# EAGLE design Controller (EAGLE 7.5.0)
CNAME: Mooring Lights Controller; CREVISION: 0.1.1; DESIGNER: John Bayly
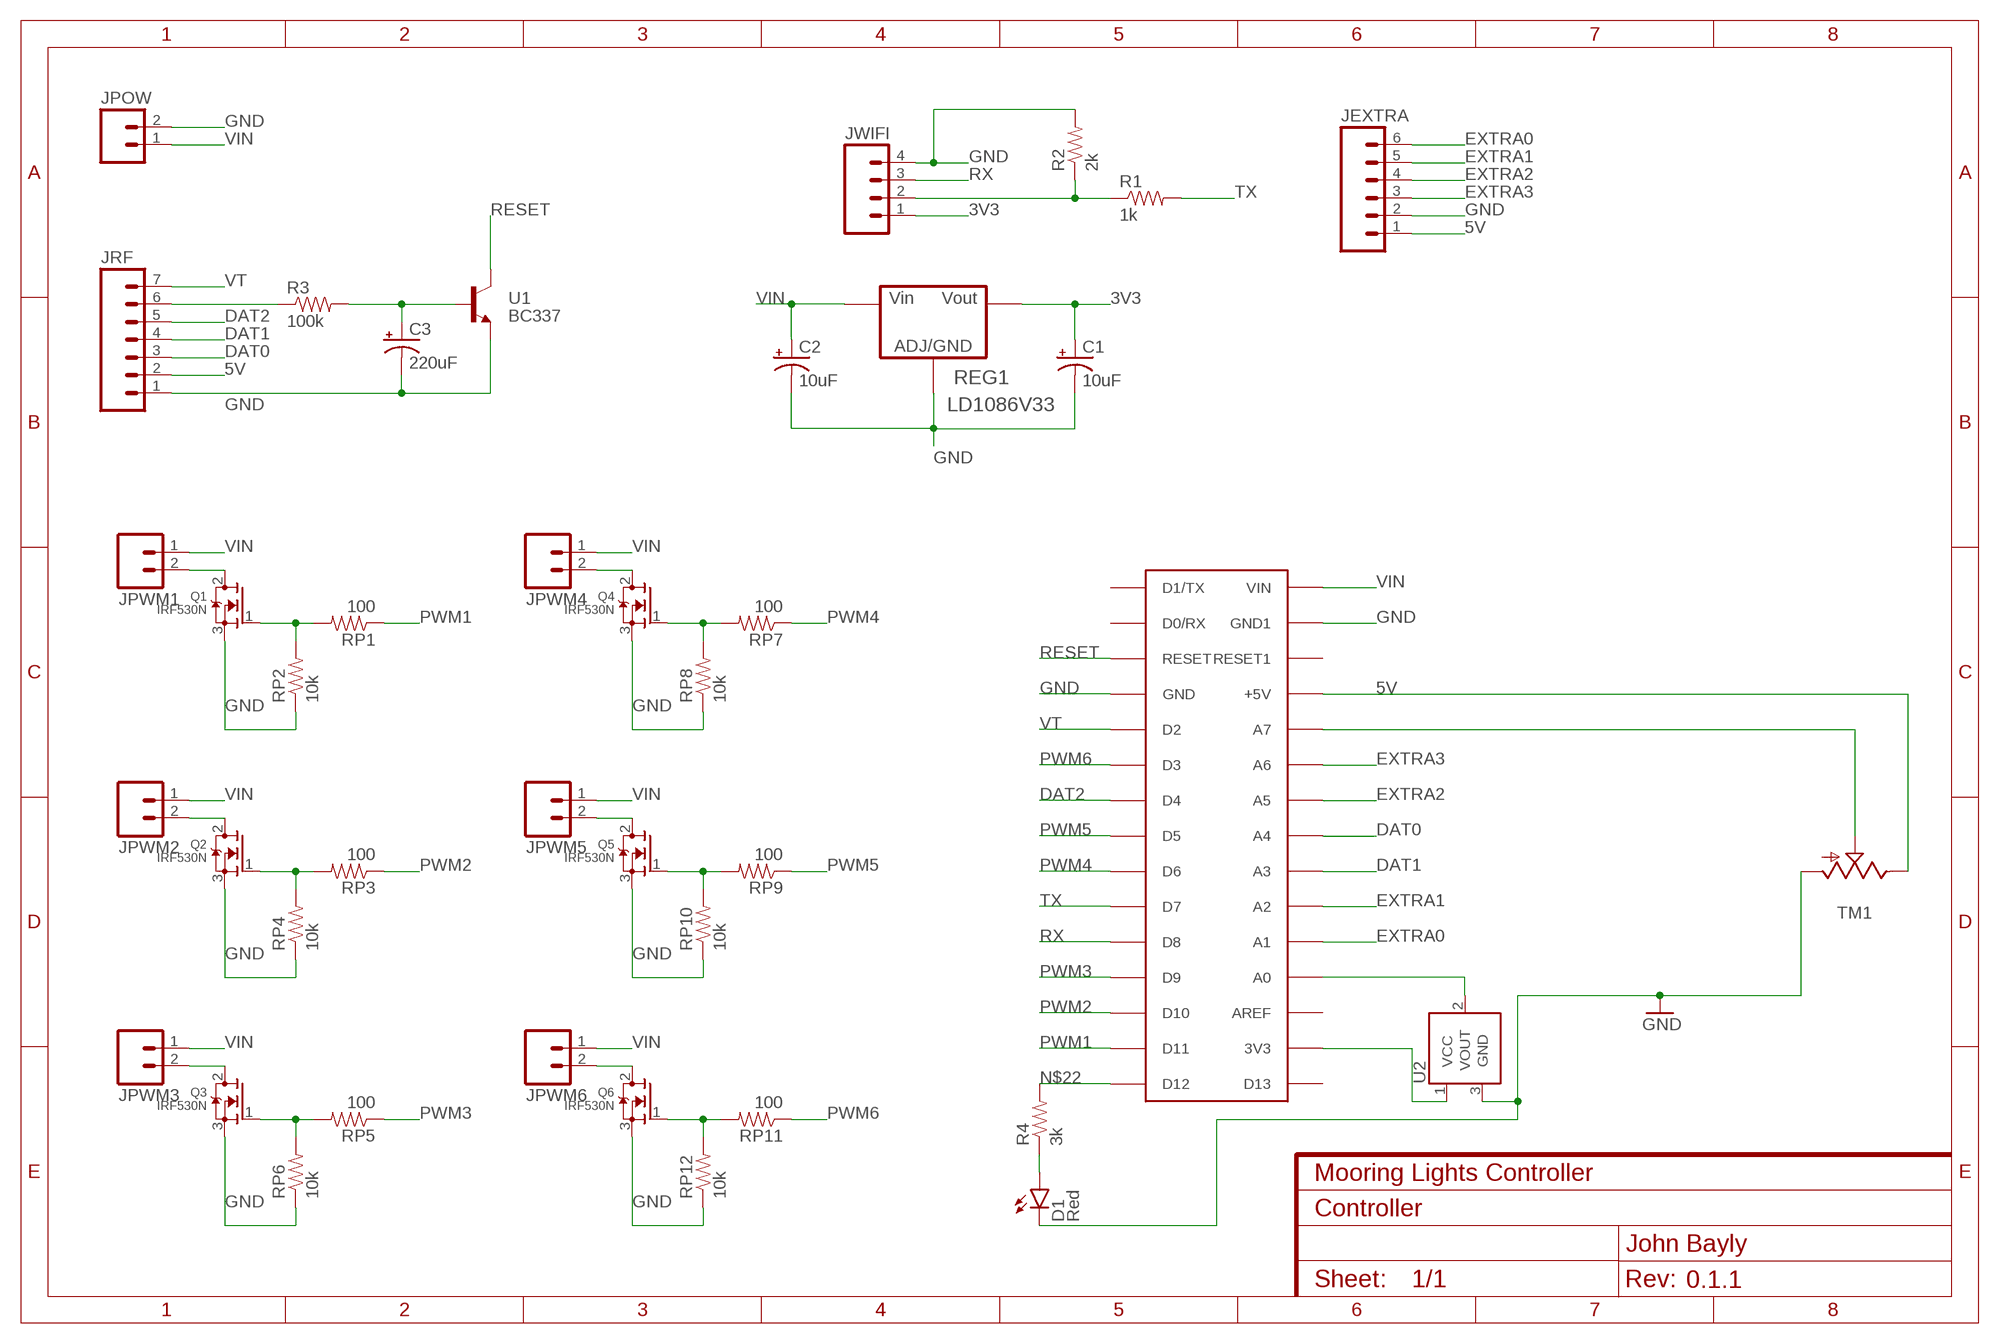
[diagram p0: schematic, sheet 1]

## Parts
C1  10uF  10UF-25V-20%(PTH)  [CPOL-RADIAL-10UF-25V]
C2  10uF  10UF-25V-20%(PTH)  [CPOL-RADIAL-10UF-25V]
C3  220uF  100UF-25V-20%(PTH)  [CPOL-RADIAL-100UF-25V]
D1  Red  LED5MM  [LED5MM]
JEXTRA  M06SILK_FEMALE_PTH  [1X06]
JPOW  M025MM  [SCREWTERMINAL-5MM-2]
JPWM1  M025MM  [SCREWTERMINAL-5MM-2]
JPWM2  M025MM  [SCREWTERMINAL-5MM-2]
JPWM3  M025MM  [SCREWTERMINAL-5MM-2]
JPWM4  M025MM  [SCREWTERMINAL-5MM-2]
JPWM5  M025MM  [SCREWTERMINAL-5MM-2]
JPWM6  M025MM  [SCREWTERMINAL-5MM-2]
JRF  M07  [1X07]
JWIFI  M04PTH  [1X04]
NANO  ARDUINONANONO-MOUNT  [PDIP-32-NO-MOUNT]
Q1  IRF530N  MOSFET-NGDS_TO220V  [TO220V]
Q2  IRF530N  MOSFET-NGDS_TO220V  [TO220V]
Q3  IRF530N  MOSFET-NGDS_TO220V  [TO220V]
Q4  IRF530N  MOSFET-NGDS_TO220V  [TO220V]
Q5  IRF530N  MOSFET-NGDS_TO220V  [TO220V]
Q6  IRF530N  MOSFET-NGDS_TO220V  [TO220V]
R1  1k  RESISTORPTH-1/4W  [AXIAL-0.4]
R2  2k  RESISTORPTH-1/4W  [AXIAL-0.4]
R3  100k  RESISTORPTH-1/4W  [AXIAL-0.4]
R4  3k  RESISTORPTH-1/4W  [AXIAL-0.4]
REG1  LD1086V33  [TO254P482X1024X3124-3P]
RP1  100  RESISTORPTH-1/4W  [AXIAL-0.4]
RP2  10k  RESISTORPTH-1/4W  [AXIAL-0.4]
RP3  100  RESISTORPTH-1/4W  [AXIAL-0.4]
RP4  10k  RESISTORPTH-1/4W  [AXIAL-0.4]
RP5  100  RESISTORPTH-1/4W  [AXIAL-0.4]
RP6  10k  RESISTORPTH-1/4W  [AXIAL-0.4]
RP7  100  RESISTORPTH-1/4W  [AXIAL-0.4]
RP8  10k  RESISTORPTH-1/4W  [AXIAL-0.4]
RP9  100  RESISTORPTH-1/4W  [AXIAL-0.4]
RP10  10k  RESISTORPTH-1/4W  [AXIAL-0.4]
RP11  100  RESISTORPTH-1/4W  [AXIAL-0.4]
RP12  10k  RESISTORPTH-1/4W  [AXIAL-0.4]
TM1  TRIM  [6MM]
U1  BC337  TRANSISTOR_NPN_2PTH  [TO-92]
U2  TMP36GT9  [TO-92]

## Nets
3V3: C1.1(+) JWIFI.1 REG1.2(VOUT)
5V: JEXTRA.1 JRF.2 NANO.+5V TM1.E
DAT0: JRF.3 NANO.A3(A4)
DAT1: JRF.4 NANO.A4(A3)
DAT2: JRF.5 NANO.D4
EXTRA0: JEXTRA.6 NANO.A6(A1)
EXTRA1: JEXTRA.5 NANO.A5(A2)
EXTRA2: JEXTRA.4 NANO.A2(A5)
EXTRA3: JEXTRA.3 NANO.A1(A6)
GND: C1.2(-) C2.2(-) C3.2(-) D1.K(C) JEXTRA.2 JPOW.2 JRF.1 JWIFI.4 NANO.GND NANO.GND1 Q1.3(S) Q2.3(S) Q3.3(S) Q4.3(S) Q5.3(S) Q6.3(S) R2.P$2 REG1.1(ADJ/GND) RP2.P$1 RP4.P$1 RP6.P$1 RP8.P$1 RP10.P$1 RP12.P$1 TM1.A U1.3(E) U2.3(GND)
N$1: NANO.A0(A7) TM1.S
N$4: JWIFI.2 R1.P$1 R2.P$1
N$5: JRF.6 R3.P$1
N$6: C3.1(+) R3.P$2 U1.2(B)
N$7: Q1.1(G) RP1.P$2 RP2.P$2
N$8: JPWM1.2 Q1.2(D)
N$9: Q2.1(G) RP3.P$2 RP4.P$2
N$10: D1.A R4.P$1
N$11: Q3.1(G) RP5.P$2 RP6.P$2
N$12: JPWM3.2 Q3.2(D)
N$13: Q4.1(G) RP7.P$2 RP8.P$2
N$14: JPWM4.2 Q4.2(D)
N$15: Q5.1(G) RP9.P$2 RP10.P$2
N$16: JPWM5.2 Q5.2(D)
N$17: Q6.1(G) RP11.P$2 RP12.P$2
N$18: JPWM6.2 Q6.2(D)
N$19: JPWM2.2 Q2.2(D)
N$20: NANO.A7(A0) U2.2(VOUT)
N$22: NANO.D12 R4.P$2
N$23: NANO.3V3 U2.1(VCC)
PWM1: NANO.D11 RP1.P$1
PWM2: NANO.D10 RP3.P$1
PWM3: NANO.D9 RP5.P$1
PWM4: NANO.D6 RP7.P$1
PWM5: NANO.D5 RP9.P$1
PWM6: NANO.D3 RP11.P$1
RESET: NANO.RESET U1.1(C)
RX: JWIFI.3 NANO.D8
TX: NANO.D7 R1.P$2
VIN: C2.1(+) JPOW.1 JPWM1.1 JPWM2.1 JPWM3.1 JPWM4.1 JPWM5.1 JPWM6.1 NANO.VIN REG1.3(VIN)
VT: JRF.7 NANO.D2
Unconnected: NANO.AREF NANO.D0/RX NANO.D1/TX NANO.D13 NANO.RESET1

## Library data of the parts
C1 C2 = SparkFun-Capacitors:10UF-25V-20%(PTH): CAP-08440; PROD_ID: CAP-08440
C3 = SparkFun-Capacitors:100UF-25V-20%(PTH): CAP-08439; PROD_ID: CAP-08439
D1 = SparkFun-LED:LED: LEDs Standard schematic elements and footprints for 5mm, 3mm, 1206, and 0603 sized LEDs. 5mm - Spark Fun Electronics SKU : COM-00529 (and others)
JEXTRA = SparkFun-Connectors:M06: Header 6 Standard 6-pin 0.1" header. Use with straight break away headers (SKU : PRT-00116), right angle break away headers (PRT-00553), swiss pins (PRT-00743), machine pins (PRT-00117), and female headers (PRT-00115). Molex polarized connector foot print use with SKU : PRT-08094 with associated crimp pins and housings. NOTES ON THE VARIANTS LOCK and LOCK_LONGPADS... This footprint was designed to help hold the alignment of a through-hole component (i.e. 6-pin header) while soldering it into place. You may notice that each hole has been shifted either up or down by 0.005 of an inch from it's more standard position (which is a perfectly straight line). This slight alteration caused the pins (the squares in the middle) to touch the edges of the holes. Because they are alternating, it causes a "brace" to hold the component in place. 0.005 has proven to be the perfect amount of "off-center" position when using our standard breakaway headers. Although looks a little odd when you look at the bare footprint, once you have a header in there, the alteration is very hard to notice. Also,if you push a header all the way into place, it is covered up entirely on the bottom side. This idea of altering the position of holes to aid alignment will be further integrated into the Sparkfun Library for other footprints. It can help hold any component with 3 or more connection pins.; PROD_ID: CONN-08437
JPOW JPWM1-JPWM6 = SparkFun-Connectors:M02: Standard 2-pin 0.1" header. Use with - straight break away headers ( PRT-00116) - right angle break away headers (PRT-00553) - swiss pins (PRT-00743) - machine pins (PRT-00117) - female headers (PRT-00115) Molex polarized connector foot print use with: PRT-08233 with associated crimp pins and housings. 2.54_SCREWTERM for use with PRT-10571. 3.5mm Screw Terminal footprints for PRT-08084 5mm Screw Terminal footprints for use with PRT-08432; STOREFRONT_ID: PRT-08432
JRF = SparkFun-Connectors:M07: Header 7 Standard 7-pin 0.1" header. Use with straight break away headers (SKU : PRT-00116), right angle break away headers (PRT-00553), swiss pins (PRT-00743), machine pins (PRT-00117), and female headers (PRT-00115). NOTES ON THE VARIANTS LOCK and LOCK_LONGPADS... This footprint was designed to help hold the alignment of a through-hole component (i.e. 7-pin header) while soldering it into place. You may notice that each hole has been shifted either up or down by 0.005 of an inch from it's more standard position (which is usually a perfectly straight line). This slight alteration caused the pins (the squares in the middle) to touch the edges of the holes. Because they are alternating, it causes a "brace" to hold the header in place. 0.005 has proven to be the perfect amount of "off-center" position when using our standard breakaway headers. Although looks a little odd when you look at the bare footprint, once you have a header in there, the alteration is very hard to notice. Also, if you push a header all the way into place, it is covered up entirely on the bottom side. This idea of altering the position of holes to aid alignment will be further integrated into the Sparkfun Library for other footprints. It can help hold any component with 3 or more connection pins.
JWIFI = SparkFun-Connectors:M04: Header 4 Standard 4-pin 0.1" header. Use with straight break away headers (SKU : PRT-00116), right angle break away headers (PRT-00553), swiss pins (PRT-00743), machine pins (PRT-00117), and female headers (PRT-00115). Molex polarized connector foot print use with SKU : PRT-08231 with associated crimp pins and housings. 1MM SMD Version SKU: PRT-10208; PROD_ID: CONN-09696
NANO = jet-lib:ARDUINONANO
Q1-Q6 = adafruit:MOSFET-N: N-Channel Mosfet 2N7002E - 60V 260mA SOT23 [Digikey: 2N7002ET1GOSTR-ND] - REEL BSH103 - 30V 850mA SOT23 [Digikey: 568-5013-1-ND]
R1-R4 RP1-RP12 = SparkFun-Passives:RESISTOR: Resistor Basic schematic elements and footprints for 0603, 1206, and PTH resistors.
REG1 = STM-LD1086V33:LD1086V33: V REG LDO 1.5A +3.3V, 1086, TO-220-3; MPN: LD1086V33; OC_FARNELL: 1087161; OC_NEWARK: 89K0611; PACKAGE: TO-220-3; SUPPLIER: STMicroelectronics
TM1 = adafruit:TRIM
U1 = SparkFun-DiscreteSemi:TRANSISTOR_NPN_2: Alternate TO-92 NPN BJT
U2 = SparkFun-Sensors:TMP36: Precision degC temp sensor, analog out

## Net classes
0 default: clearance 0.508 mm

## Board
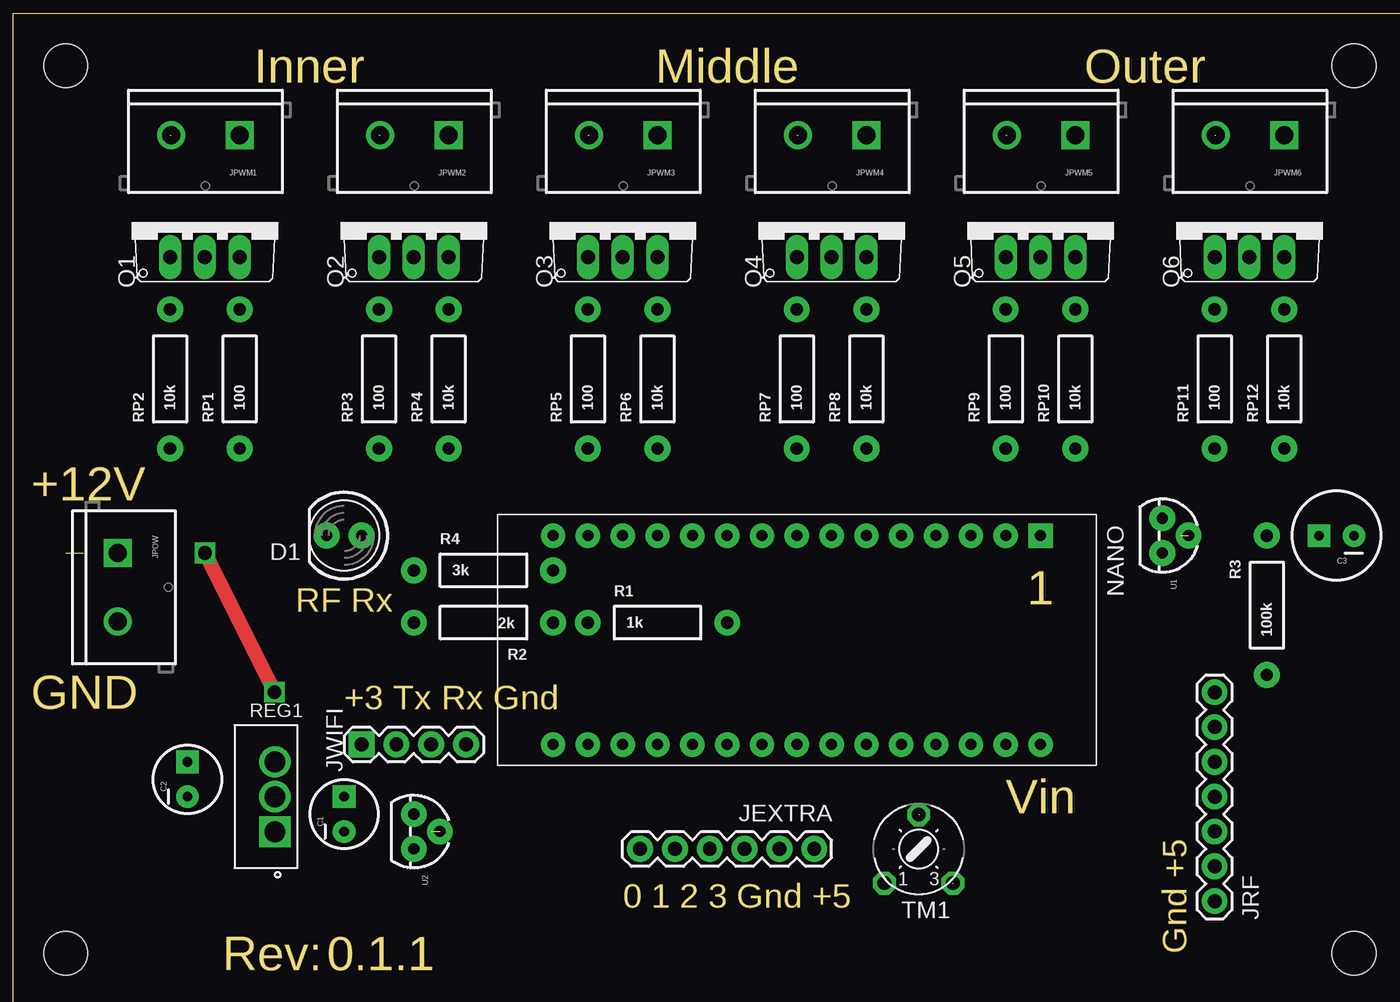
[diagram p1: board, top side]
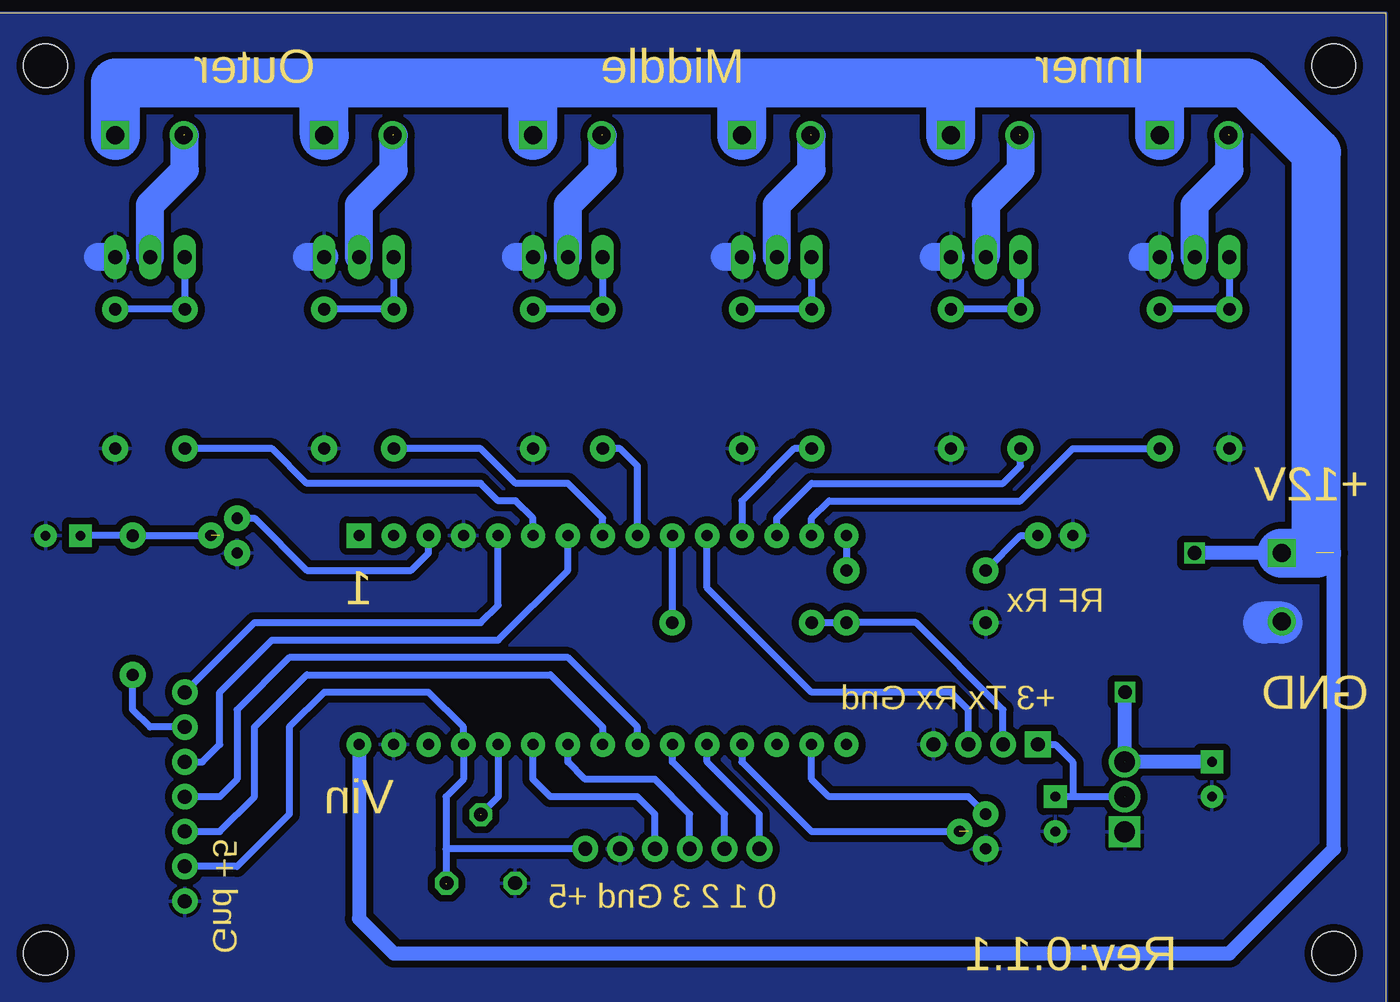
[diagram p2: board, bottom side, seen from below]

No outline drawn. Coordinates in mm, seen from the top.
Copper layers (1*16): Top 0.035mm / dielectric 1.5mm / Bottom 0.035mm
Design rules "SparkFun": minimum track width 8mil, minimum drill 20mil, track to track 8mil, track to pad 8mil, pad to pad 8mil, via to via 8mil, smd to smd 8mil, copper to edge 10mil, drill to drill 8mil, minimum pad ring 12mil, minimum via ring 10mil, stop-mask expansion 4mil, vias tented up to drill 25mil, thermal gap 10mil
Holes 3.2 mm at 3.81,68.58 97.79,68.58 97.79,3.81 3.81,3.81
Milling: 4 lines

### Footprints (pad centres in the part's own frame; a part is rotated, then mirrored left to right if it is on the bottom)
CPOL-RADIAL-10UF-25V = drill 0.7 pad 1.651 square: 1 1.27,0 | drill 0.7 pad 1.651: 2 -1.27,0
CPOL-RADIAL-100UF-25V = drill 0.7 pad 1.651 square: 1 1.27,0 | drill 0.7 pad 1.651: 2 -1.27,0
LED5MM = drill 0.813 pad 1.88: A -1.27,0; K 1.27,0
1X06 = drill 1.016 pad 1.88: 1 0,0; 2 2.54,0; 3 5.08,0; 4 7.62,0; 5 10.16,0; 6 12.7,0
SCREWTERMINAL-5MM-2 = drill 1.3 pad 2.032 square: 1 0,0 | drill 1.3 pad 2.032: 2 5,0
1X07 = drill 1.016 pad 1.88: 1 0,0; 2 2.54,0; 3 5.08,0; 4 7.62,0; 5 10.16,0; 6 12.7,0; 7 15.24,0
1X04 = drill 1.016 pad 1.88 square: 1 0,0 | drill 1.016 pad 1.88: 2 2.54,0; 3 5.08,0; 4 7.62,0
PDIP-32-NO-MOUNT = drill 0.8 pad 1.778: 3V3 15.24,-35.56; +5V 15.24,-10.16; A0 15.24,-12.7; A1 15.24,-15.24; A2 15.24,-17.78; A3 15.24,-20.32; A4 15.24,-22.86; A5 15.24,-25.4; A6 15.24,-27.94; A7 15.24,-30.48; AREF 15.24,-33.02; D0/RX 0,-5.08; D2 0,-12.7; D3 0,-15.24; D4 0,-17.78; D5 0,-20.32; D6 0,-22.86; D7 0,-25.4; D8 0,-27.94; D9 0,-30.48; D10 0,-33.02; D11 0,-35.56; D12 0,-38.1; D13 15.24,-38.1; GND 0,-10.16; GND1 15.24,-5.08; RESET 0,-7.62; RESET1 15.24,-7.62; VIN 15.24,-2.54 | drill 0.8 pad 1.778 square: D1/TX 0,-2.54
TO220V = drill 1.016 long: 1 -2.54,-2.54; 2 0,-2.54; 3 2.54,-2.54
AXIAL-0.4 = drill 0.9 pad 1.88: P$1 -5.08,0; P$2 5.08,0
TO254P482X1024X3124-3P = drill 1.524 square: 1 -5.105,-1.295 | drill 1.524: 2 -2.54,-1.295; 3 0,-1.295
6MM = drill 1 pad 1.676 octagon: A -2.5,-2.5; E 2.5,-2.5; S 0,2.5
TO-92 = drill 0.813 pad 1.88: 1 -1.27,0; 2 0,1.905; 3 1.27,0

### Placement (x,y rotation side)
C1  24.13,13.97 90 top
C2  12.7,16.51 90 top
C3  96.52,34.29 180 top
D1  24.13,34.29 180 top
JEXTRA  58.42,11.43 180 top
JPOW  7.62,33.02 270 top
JPWM1  16.51,63.5 180 top
JPWM2  31.75,63.5 180 top
JPWM3  46.99,63.5 180 top
JPWM4  62.23,63.5 180 top
JPWM5  77.47,63.5 180 top
JPWM6  92.71,63.5 180 top
JRF  87.63,7.62 90 top
JWIFI  25.4,19.05 0 top
NANO  77.47,34.29 270 top
Q1  13.97,57.15 0 top
Q2  29.21,57.15 0 top
Q3  44.45,57.15 0 top
Q4  59.69,57.15 0 top
Q5  74.93,57.15 0 top
Q6  90.17,57.15 0 top
R1  46.99,27.94 0 top
R2  34.29,27.94 180 top
R3  91.44,29.21 90 top
R4  34.29,31.75 0 top
REG1  17.78,17.78 90 top
RP1  16.51,45.72 90 top
RP2  11.43,45.72 90 top
RP3  26.67,45.72 90 top
RP4  31.75,45.72 90 top
RP5  41.91,45.72 90 top
RP6  46.99,45.72 90 top
RP7  57.15,45.72 90 top
RP8  62.23,45.72 90 top
RP9  72.39,45.72 90 top
RP10  77.47,45.72 90 top
RP11  87.63,45.72 90 top
RP12  92.71,45.72 90 top
TM1  66.04,11.43 0 top
U1  83.82,34.29 270 top
U2  29.21,12.7 270 top

### Tracks (layer width: path | path; a pad name or v marks a point on that pad's centre or on a via)
3V3  (1 unrouted)
  Bottom 0.508: 19.05,15.24 22.86,15.24 | 22.86,15.24 C1.1 | JWIFI.1 24.13,19.05 22.86,17.78 22.86,15.24
5V  (1 unrouted)
  Bottom 0.508: JEXTRA.1 68.58,11.43 | 68.58,11.43 68.58,8.89 | JRF.2 83.82,10.16 80.01,13.97 80.01,20.32 77.47,22.86 69.85,22.86 67.31,20.32 NANO.+5V 67.31,16.51 68.58,15.24 68.58,11.43
DAT0
  Bottom 0.508: JRF.3 85.09,12.7 82.55,15.24 82.55,20.32 78.74,24.13 60.96,24.13 57.15,20.32 NANO.A3
DAT1
  Bottom 0.508: NANO.A4 54.61,20.32 59.69,25.4 80.01,25.4 83.82,21.59 83.82,16.51 85.09,15.24 JRF.4
DAT2
  Bottom 0.508: JRF.5 86.36,17.78 85.09,19.05 85.09,22.86 81.28,26.67 64.77,26.67 59.69,31.75 NANO.D4
EXTRA0
  Bottom 0.508: JEXTRA.6 45.72,13.97 49.53,17.78 NANO.A6
EXTRA1
  Bottom 0.508: JEXTRA.5 48.26,13.97 52.07,17.78 NANO.A5
EXTRA2
  Bottom 0.508: JEXTRA.4 50.8,13.97 53.34,16.51 58.42,16.51 59.69,17.78 NANO.A2
EXTRA3
  Bottom 0.508: JEXTRA.3 53.34,13.97 54.61,15.24 60.96,15.24 62.23,16.51 NANO.A1
GND
  Bottom 2.032: Q1.3 17.78,54.61 | Q2.3 33.02,54.61 | Q3.3 48.26,54.61 | Q4.3 63.5,54.61 | Q5.3 78.74,54.61 | Q6.3 93.98,54.61
  Bottom 3.048: 7.62,27.94 8.89,27.94
  pour Bottom (isolate 0.508): 0,72.39 0,0 101.6,0 101.6,72.39
N$1  (1 unrouted)
  Bottom 0.508: NANO.A0 64.77,15.24 66.04,13.97
N$4
  Bottom 0.508: R1.P$1 R2.P$1 34.29,27.94 27.94,21.59 JWIFI.2
N$5
  Bottom 0.508: JRF.6 90.17,20.32 91.44,21.59 R3.P$1
N$6  (1 unrouted)
  Bottom 0.508: 85.09,34.29 R3.P$2 C3.1
N$7
  Bottom 0.508: Q1.1 RP2.P$2 RP1.P$2
N$8  (1 unrouted)
  Bottom 2.032: Q1.2 13.97,58.42 11.43,60.96 11.43,63.5
N$9
  Bottom 0.508: Q2.1 RP3.P$2 RP4.P$2
N$10
  Bottom 0.508: R4.P$1 26.67,34.29 D1.A
N$11
  Bottom 0.508: Q3.1 RP5.P$2 RP6.P$2
N$12  (1 unrouted)
  Bottom 2.032: Q3.2 44.45,58.42 41.91,60.96 41.91,63.5
N$13
  Bottom 0.508: Q4.1 RP7.P$2 RP8.P$2
N$14  (1 unrouted)
  Bottom 2.032: Q4.2 59.69,58.42 57.15,60.96 57.15,63.5
N$15
  Bottom 0.508: Q5.1 RP9.P$2 RP10.P$2
N$16  (1 unrouted)
  Bottom 2.032: Q5.2 74.93,58.42 72.39,60.96 72.39,63.5
N$17
  Bottom 0.508: Q6.1 RP11.P$2 RP12.P$2
N$18  (1 unrouted)
  Bottom 2.032: Q6.2 90.17,58.42 87.63,60.96 87.63,63.5
N$19  (1 unrouted)
  Bottom 2.032: 26.67,63.5 26.67,60.96 29.21,58.42 Q2.2
N$20  (1 unrouted)
  Bottom 0.508: NANO.A7 46.99,17.78 41.91,12.7 30.48,12.7
N$22
  Bottom 0.508: NANO.D12 R4.P$2
N$23
  Bottom 0.508: U2.1 30.48,15.24 40.64,15.24 41.91,16.51 NANO.3V3
PWM1
  Bottom 0.508: NANO.D11 41.91,35.56 40.64,36.83 26.67,36.83 22.86,40.64 RP1.P$1
PWM2
  Bottom 0.508: NANO.D10 44.45,35.56 41.91,38.1 27.94,38.1 26.67,39.37 RP3.P$1
PWM3
  Bottom 0.508: RP5.P$1 43.18,40.64 46.99,36.83 NANO.D9
PWM4
  Bottom 0.508: NANO.D6 54.61,39.37 55.88,40.64 RP7.P$1
PWM5
  Bottom 0.508: NANO.D5 57.15,35.56 59.69,38.1 63.5,38.1 66.04,40.64 RP9.P$1
PWM6
  Bottom 0.508: NANO.D3 62.23,35.56 63.5,36.83 64.77,36.83 66.04,38.1 78.74,38.1 81.28,40.64 RP11.P$1
RESET
  Bottom 0.508: U1.1 82.55,35.56 78.74,31.75 71.12,31.75 69.85,33.02 NANO.RESET
RX
  Bottom 0.508: NANO.D8 49.53,30.48 41.91,22.86 31.75,22.86 30.48,21.59 JWIFI.3
TX
  Bottom 0.508: R1.P$2 NANO.D7
VIN  (via drill 1)  (2 unrouted)
  Top 1.016: v13.97,33.02 v19.05,22.86
  Bottom 1.016: 3.81,33.02 3.81,11.43 11.43,3.81 72.39,3.81 74.93,6.35 NANO.VIN | JPOW.1 v13.97,33.02 | C2.1 19.05,17.78 v19.05,22.86
  Bottom 3.556: JPOW.1 5.08,33.02 5.08,62.23 10.16,67.31 16.51,67.31 | 16.51,67.31 31.75,67.31 | 31.75,67.31 46.99,67.31 | 46.99,67.31 62.23,67.31 | 62.23,67.31 77.47,67.31 | 77.47,67.31 92.71,67.31 JPWM6.1 | JPWM5.1 77.47,67.31 | JPWM4.1 62.23,67.31 | JPWM3.1 46.99,67.31 | JPWM2.1 31.75,67.31 | JPWM1.1 16.51,67.31
VT
  Bottom 0.508: JRF.7 82.55,27.94 66.04,27.94 64.77,29.21 NANO.D2

### Text on the board
Milling: Inner | Middle | Outer | +12V | 1 | RF Rx | GND | +3 Tx Rx Gnd | Vin | 0 1 2 3 Gnd +5 | Rev: | Gnd +5